# EAGLE design ownduino-metaboard2 (EAGLE 6.1)
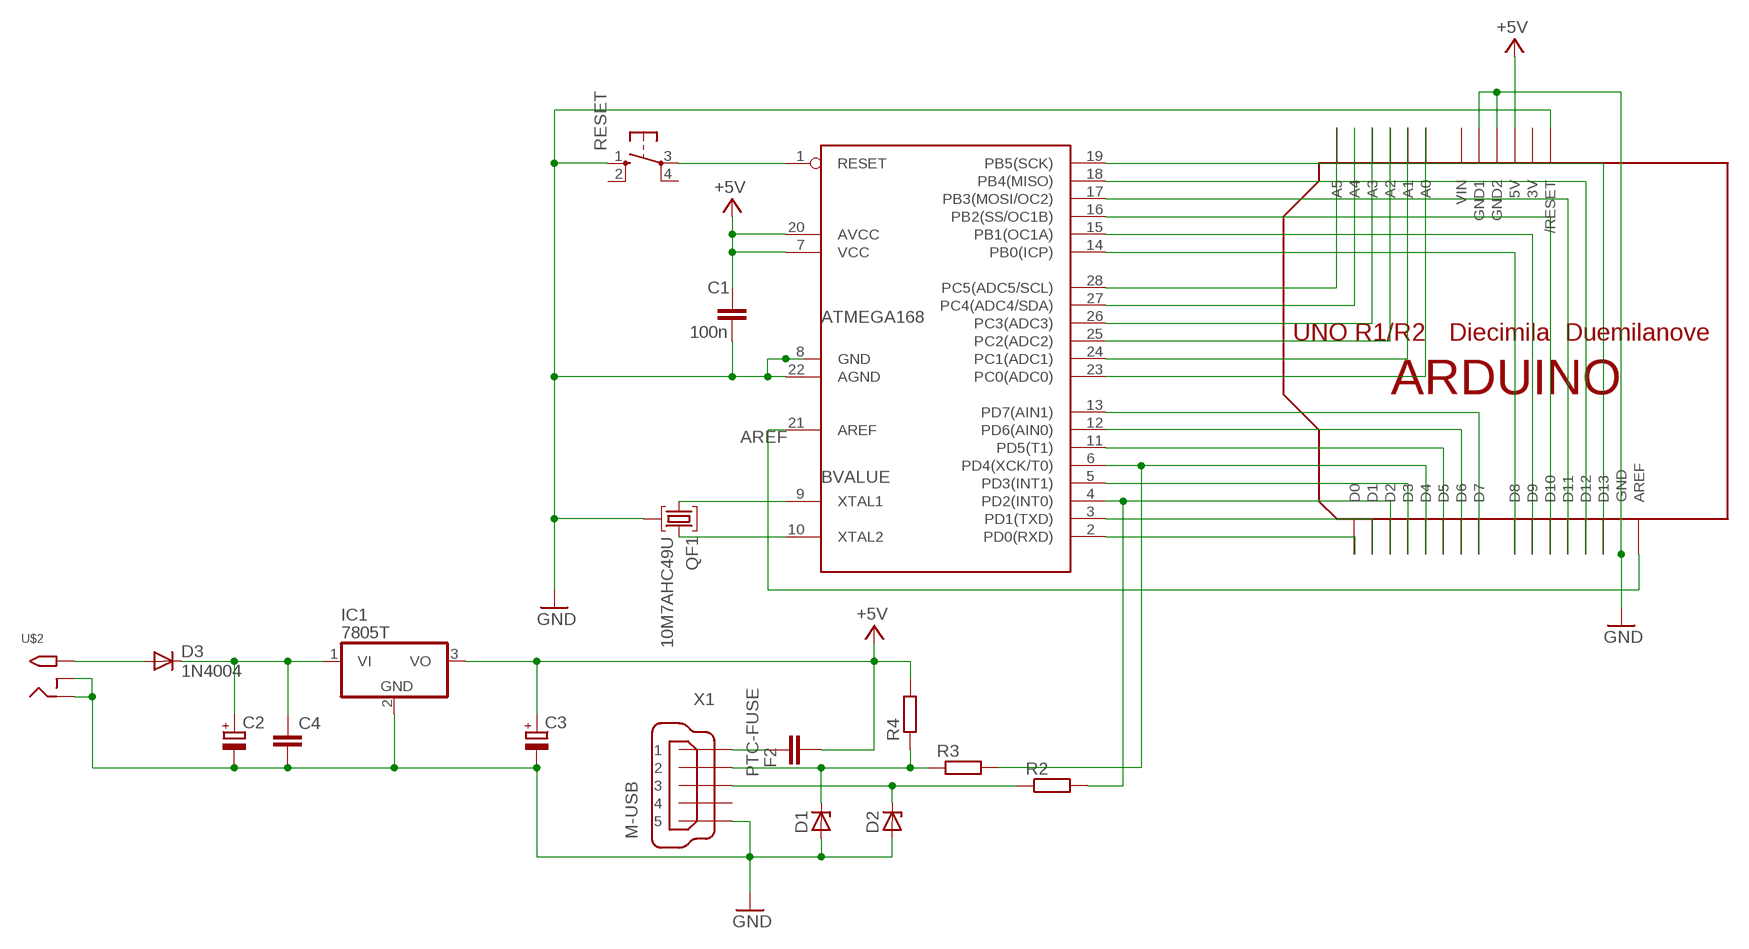
[diagram p0: schematic, sheet 1]

## Parts
BVALUE  ATMEGA168  MEGA8-P  [DIL28-3]
C1  100n  C-EU025-024X044  [C025-024X044]
C2  CPOL-EUE5-8.5  [E5-8,5]
C3  CPOL-EUE5-8.5  [E5-8,5]
C4  C-EU025-025X050  [C025-025X050]
D1  ZENER-DIODEZD-7.5  [ZDIO-7.5]
D2  ZENER-DIODEZD-5  [ZDIO-5]
D3  1N4004  [DO41-10]
F2  PTC-FUSE  C-EU025_050-025X075  [C025_050-025X075]
IC1  7805T  [TO220H]
QF1  10M7AHC49U  [HC49U]
R2  R-EU_0207/12  [0207/12]
R3  R-EU_0207/10  [0207/10]
R4  R-EU_0207/10  [0207/10]
RESET  10-XX  [B3F-10XX]
U$1  ARDUINOUNO  [ARDUINO]
U$2  2.1MMJACKTHM  [PJ-102A]
X1  M-USB  MINI-USB_SHIELD5P2-32005-601  [32005-601]

## Nets
+5V [power]: BVALUE.7(VCC) BVALUE.20(AVCC) C1.1 C3.+ F2.1 IC1.3(VO) R4.2 U$1.5V
A0: BVALUE.23(PC0(ADC0)) U$1.A0
A1: BVALUE.24(PC1(ADC1)) U$1.A1
A2: BVALUE.25(PC2(ADC2)) U$1.A2
A3: BVALUE.26(PC3(ADC3)) U$1.A3
A4: BVALUE.27(PC4(ADC4/SDA)) U$1.A4
A5: BVALUE.28(PC5(ADC5/SCL)) U$1.A5
AREF: BVALUE.21(AREF) U$1.AREF
D0: BVALUE.2(PD0(RXD)) U$1.D0
D1: BVALUE.3(PD1(TXD)) U$1.D1
D2: BVALUE.4(PD2(INT0)) R2.2 U$1.D2
D3: BVALUE.5(PD3(INT1)) U$1.D3
D4: BVALUE.6(PD4(XCK/T0)) R3.2 U$1.D4
D5: BVALUE.11(PD5(T1)) U$1.D5
D6: BVALUE.12(PD6(AIN0)) U$1.D6
D7: BVALUE.13(PD7(AIN1)) U$1.D7
D8: BVALUE.14(PB0(ICP)) U$1.D8
D9: BVALUE.15(PB1(OC1A)) U$1.D9
D10: BVALUE.16(PB2(SS/OC1B)) U$1.D10
D11-MOSI: BVALUE.17(PB3(MOSI/OC2)) U$1.D11
D12-MISO: BVALUE.18(PB4(MISO)) U$1.D12
D13-SCK: BVALUE.19(PB5(SCK)) U$1.D13
D+: D2.C R2.1 X1.3
D-: D1.C R3.1 R4.1 X1.2
GND [power]: BVALUE.8(GND) BVALUE.22(AGND) C1.2 C2.- C3.- C4.2 D1.A D2.A IC1.2(GND) QF1.2 RESET.1(S) U$1.GND U$1.GND1 U$1.GND2 U$1.RESET(/RESET) U$2.RING U$2.RING_SW X1.5
N$2: BVALUE.1(RESET) RESET.3(P)
N$3: C2.+ C4.1 D3.C IC1.1(VI)
N$4: D3.A U$2.TIP
N$5: BVALUE.9(XTAL1) QF1.1
N$6: BVALUE.10(XTAL2) QF1.3
N$38: F2.2 X1.1
Unconnected: RESET.2(S1) RESET.4(P1) X1.4 X1.M1(S1) X1.M2(S2)

## Power pins joined to a net without a drawn wire
3V: U$1.3V
VIN: U$1.VIN

## Library data of the parts
BVALUE = my-library:MEGA8-P: MICROCONTROLLER 8 Kbytes FLASH 1 kbytes SRAM 512 bytes EEPROM USART 4-channel 10 bit ADC 2-channel 8 bit ADC Source: avr.lbr
C1 C4 F2 = rcl:C-EU: CAPACITOR, European symbol
C2 C3 = rcl:CPOL-EU: POLARIZED CAPACITOR, European symbol
D1 D2 = diode:ZENER-DIODE: Z-Diode
D3 = diode:1N4004: DIODE general purpose rectifier, 1 A
IC1 = adafruit:78*: Positive VOLTAGE REGULATOR Added bigger pads to the TO-92 package
QF1 = crystal:10M*A: Monolithic Crystal Filters Source: www.vanlong.com; OC_FARNELL: unknown; OC_NEWARK: unknown
R2-R4 = rcl:R-EU_: RESISTOR, European symbol
RESET = switch-omron:10-XX: OMRON SWITCH
U$1 = adafruit:ARDUINO: Arduino Diecimila/Duemilanove Make a shield with ease, this package has all the named pins as well as the two mounting drill holes and an outline of the USB and DC power connector. The outline is on the DIMENSION layer, so if your board house uses it they will cut the outline to match. http://www.ladyada.net/library/pcb/eaglelibrary.html
U$2 = adafruit:2.1MMJACK: 2.1mm x 5.5mm THM DC jack with internal switch. Digikey part #PJ-102A, 4UCON part #05537 2.1mm x 5.5mm SMT DC jack with internal switch. Digikey part #PJ-002A-SMT, 4UCON part #03267 By microbuilder.eu & adafruit.com
X1 = con-cypressindustries:MINI-USB_SHIELD5P2-: MINI USB-B R/A DIP 5pol. Source: www.cypressindustries.com; OC_FARNELL: unknown; OC_NEWARK: unknown

## Net classes
0 default: width 0.203 mm, clearance 0.203 mm
1 power: width 0.6 mm, clearance 0.305 mm
2 finepitch: width 0.203 mm, clearance 0.203 mm

## Board
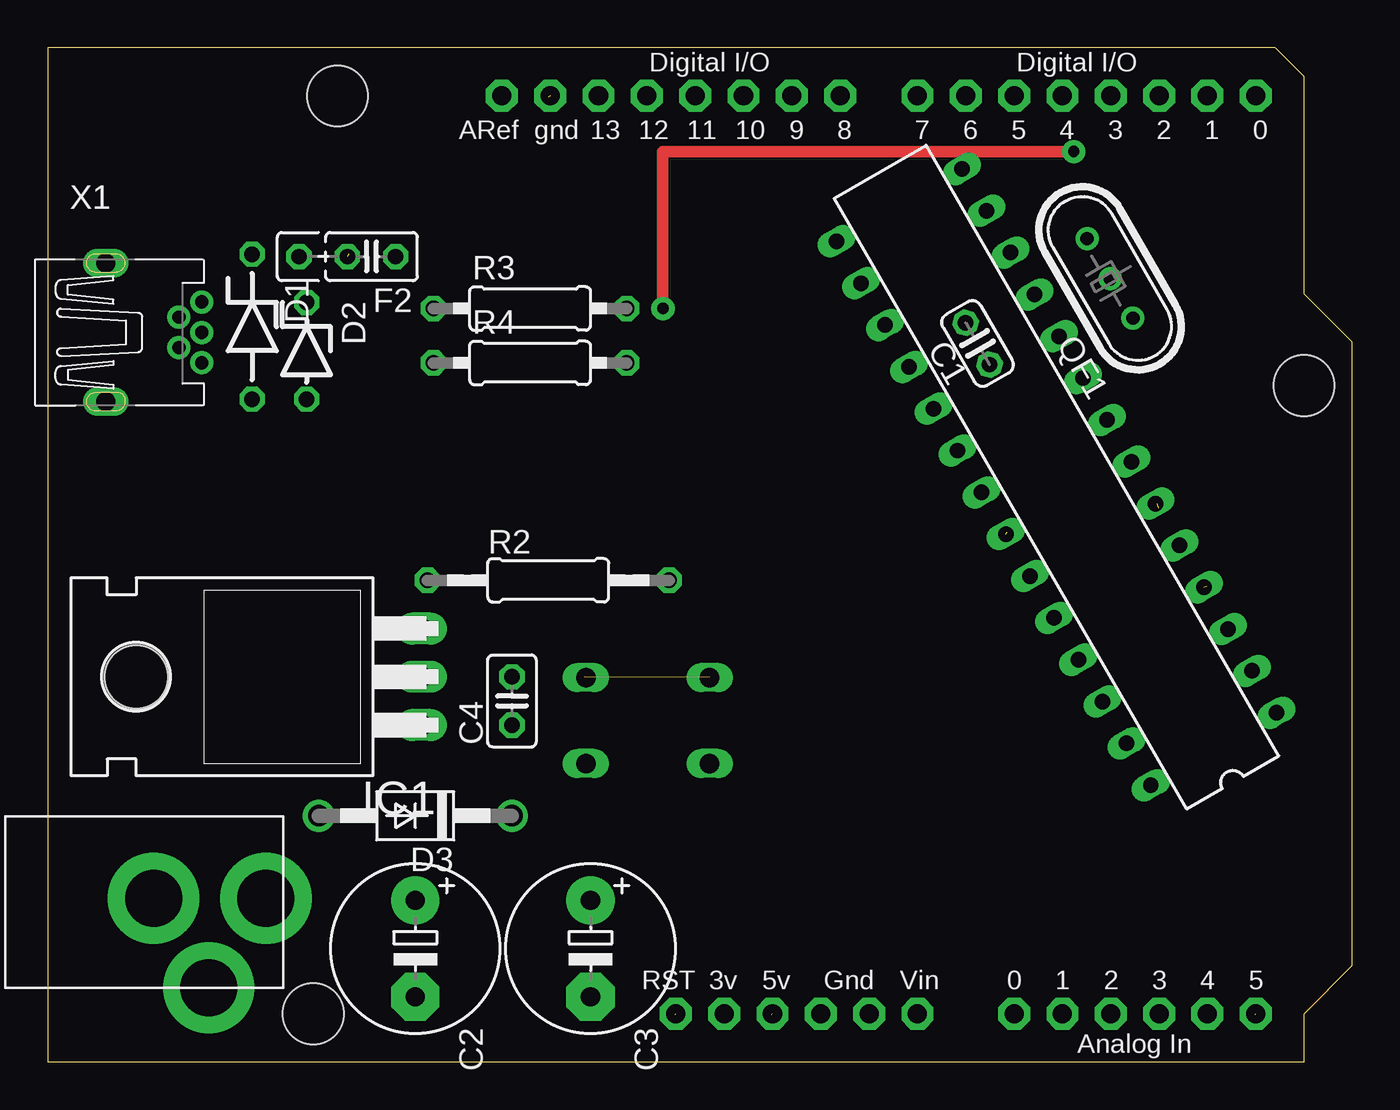
[diagram p1: board, top side]
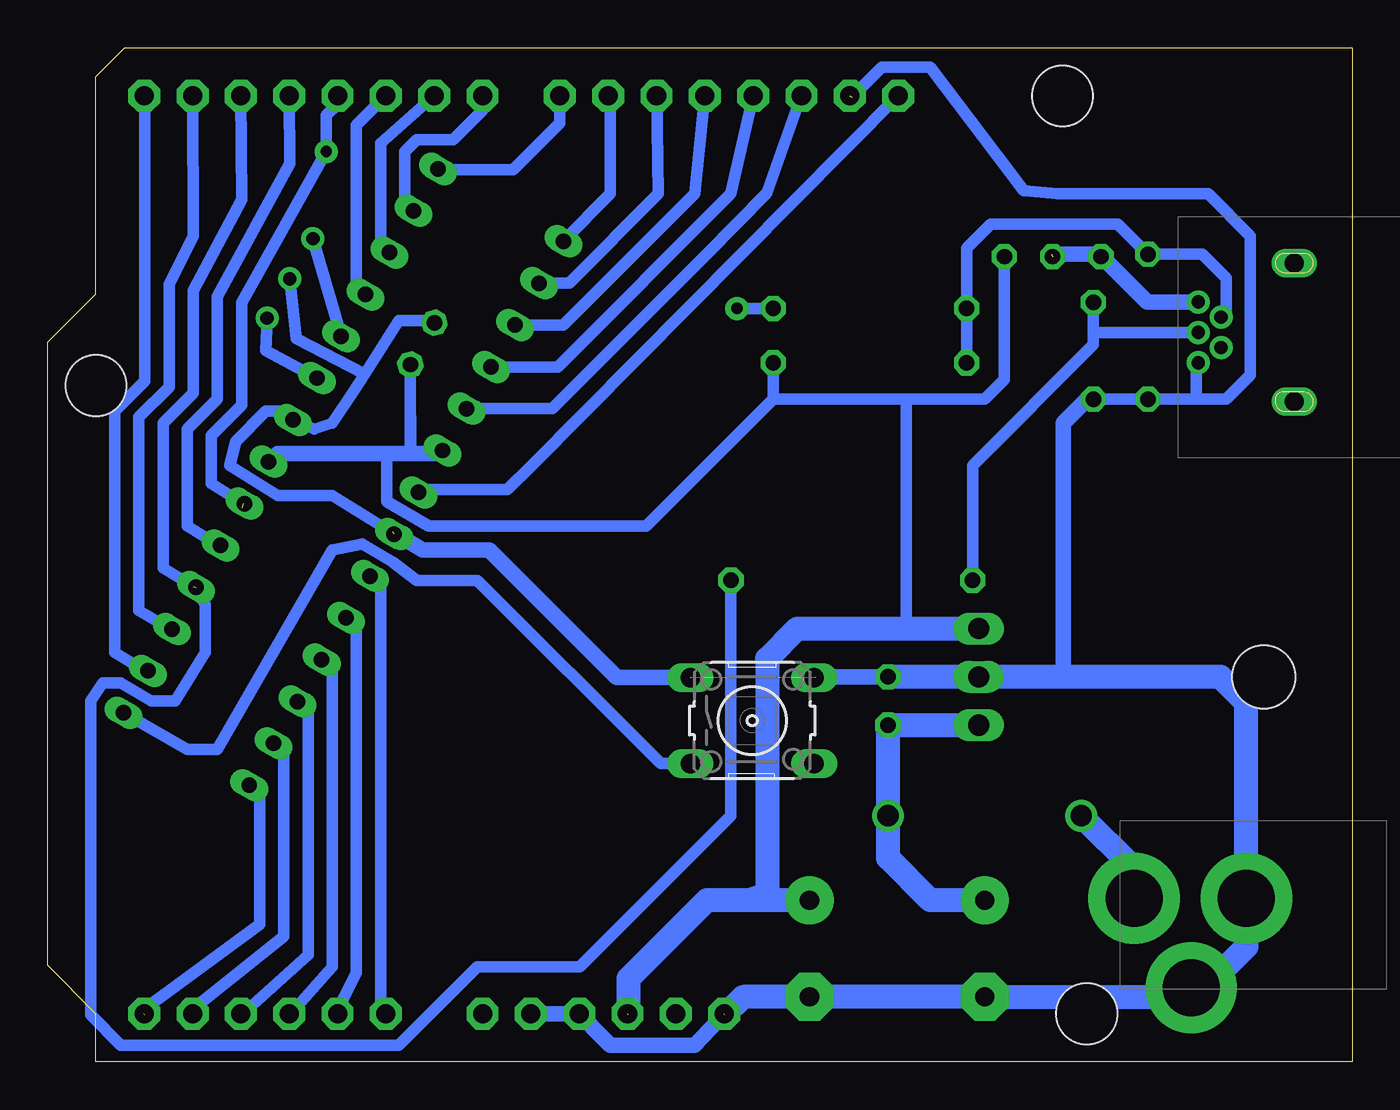
[diagram p2: board, bottom side, seen from below]

Size 68.58 x 53.34 mm. Coordinates in mm from the lower left corner, seen from the top.
Copper layers (1*16): Top 0.035mm / dielectric 1.5mm / Bottom 0.035mm
Design rules: minimum track width 10mil, minimum drill 0.6mm, track to track 8mil, track to pad 8mil, pad to pad 8mil, via to via 12mil, smd to smd 8mil, copper to edge 10mil, drill to drill 15mil, minimum pad ring 10mil, minimum via ring 12mil, stop-mask expansion 4mil, vias tented up to drill 0mil, thermal gap 10mil
Holes 3.2 mm at 67.03,138.64 67.03,110.7 16.23,153.88
tRestrict: area 14.3,152 to 18.1,155.8; area 65.1,136.7 to 68.9,140.5; area 65.1,108.8 to 68.9,112.6; 10 lines
bRestrict: area 14.3,152 to 18.1,155.8; area 65.1,136.7 to 68.9,140.5; area 65.1,108.8 to 68.9,112.6; 8 lines

### Footprints (pad centres in the part's own frame; a part is rotated, then mirrored left to right if it is on the bottom)
DIL28-3 = drill 0.813 long: 1 -16.51,-3.81; 2 -13.97,-3.81; 3 -11.43,-3.81; 4 -8.89,-3.81; 5 -6.35,-3.81; 6 -3.81,-3.81; 7 -1.27,-3.81; 8 1.27,-3.81; 9 3.81,-3.81; 10 6.35,-3.81; 11 8.89,-3.81; 12 11.43,-3.81; 13 13.97,-3.81; 14 16.51,-3.81; 15 16.51,3.81; 16 13.97,3.81; 17 11.43,3.81; 18 8.89,3.81; 19 6.35,3.81; 20 3.81,3.81; 21 1.27,3.81; 22 -1.27,3.81; 23 -3.81,3.81; 24 -6.35,3.81; 25 -8.89,3.81; 26 -11.43,3.81; 27 -13.97,3.81; 28 -16.51,3.81
C025-024X044 = drill 0.813 octagon: 1 -1.27,0; 2 1.27,0
E5-8,5 = drill 1.016 pad 2.54: + -2.54,0 | drill 1.016 pad 2.54 octagon: - 2.54,0
C025-025X050 = drill 0.813 octagon: 1 -1.27,0; 2 1.27,0
ZDIO-7.5 = drill 0.813 octagon: A 3.81,0; C -3.81,0
ZDIO-5 = drill 0.813 octagon: A 2.54,0; C -2.54,0
DO41-10 = drill 1.118: A 5.08,0; C -5.08,0
C025_050-025X075 = drill 0.813 octagon: 1 -1.27,0; 2 1.27,0; 3 3.81,0
TO220H = drill 1.118 long: 1 -2.54,-10.16; 2 0,-10.16; 3 2.54,-10.16 | hole 3.302: 0,4.826
HC49U = drill 0.7 pad 1.2: 1 -2.413,0; 2 -0.027,0; 3 2.413,0
0207/12 = drill 0.813 octagon: 1 -6.35,0; 2 6.35,0
0207/10 = drill 0.813 octagon: 1 -5.08,0; 2 5.08,0
B3F-10XX = drill 1.016 long: 1 -3.251,2.261; 2 3.251,2.261; 3 -3.251,-2.261; 4 3.251,-2.261
ARDUINO = drill 1 pad 1.676 octagon: 3V 35.56,2.54; 5V 38.1,2.54; A0 50.8,2.54; A1 53.34,2.54; A2 55.88,2.54; A3 58.42,2.54; A4 60.96,2.54; A5 63.5,2.54; AREF 23.876,50.8; D0 63.5,50.8; D1 60.96,50.8; D2 58.42,50.8; D3 55.88,50.8; D4 53.34,50.8; D5 50.8,50.8; D6 48.26,50.8; D7 45.72,50.8; D8 41.656,50.8; D9 39.116,50.8; D10 36.576,50.8; D11 34.036,50.8; D12 31.496,50.8; D13 28.956,50.8; GND 26.416,50.8; GND1 43.18,2.54; GND2 40.64,2.54; RESET 33.02,2.54; VIN 45.72,2.54 | hole 3.2: 15.24,50.8; 66.04,35.56; 13.97,2.54
PJ-102A = drill 3 pad 4.8: RING 0.1,-3.39; RING_SW -4.6,-6.29; TIP 0.1,-9.29
32005-601 = drill 0.7 pad 1.016: 1 2.825,1.6; 2 1.625,0.8; 3 2.825,0; 4 1.625,-0.8; 5 2.825,-1.6 | drill 1 pad 1.422 long: M1 -2.225,3.65; M2 -2.225,-3.65

### Placement (x,y rotation side)
BVALUE  53.03,30.76 120 top
C1  48.88,37.77 120 top
C2  19.33,5.96 270 top
C3  28.54,5.96 270 top
C4  24.41,18.98 90 top
D1  10.76,38.67 270 top
D2  13.61,37.4 270 top
D3  19.33,12.95 180 top
F2  17.03,42.35 180 top
IC1  9.49,20.25 90 top
QF1  55.84,41.21 120 top
R2  26.31,25.33 0 top
R3  25.36,39.62 0 top
R4  25.36,36.76 0 top
RESET  31.54,17.95 0 bottom
U$1  0,0 0 top
U$2  2.18,8.5 90 top
X1  5.28,38.36 0 top

### Tracks (layer width: path | path; a pad name or v marks a point on that pad's centre or on a via)
+5V  (1 unrouted)
  Bottom 0.61: 48.22,32 BVALUE.20 50.76,32 50.76,29.46 48.54,28.19 37.11,28.19 30.44,34.85 | F2.1 18.3,35.88 19.33,34.85 23.46,34.85 | 30.12,36.76 30.44,36.44 R4.2 30.44,34.85 | 23.46,22.79 23.46,34.85 | 23.46,34.85 30.44,34.85 | C1.1 49.52,32.02 49.49,32 49.49,33.9
  Bottom 0.813: 48.22,32 49.49,32 50.76,32 56.47,32 BVALUE.7
  Bottom 1.27: 38.06,2.47 38.06,4.37 33.93,8.5 31.71,8.5 | IC1.3 23.46,22.79 29.17,22.79 30.76,21.2 30.76,8.82 31.71,8.5 | C3.+ 31.71,8.5
A0
  Bottom 0.61: BVALUE.23 51.3,25.55 51.08,25.33 51.08,2.82 U$1.A0
A1
  Bottom 0.61: BVALUE.24 52.59,23.35 52.35,23.11 52.35,4.69 53.3,2.79 53.3,2.58 U$1.A1
A2
  Bottom 0.61: BVALUE.25 53.88,21.15 53.62,20.88 53.62,5.01 55.84,2.47 55.84,2.58 U$1.A2
A3
  Bottom 0.61: BVALUE.26 55.44,18.9 54.89,18.35 54.89,5.65 58.38,2.47 U$1.A3
A4
  Bottom 0.61: BVALUE.27 56.47,16.75 56.16,16.44 56.16,6.6 60.92,2.79 U$1.A4
A5  (1 unrouted)
  Bottom 0.61: BVALUE.28 57.76,14.55 57.43,14.22 57.43,7.23 63.46,2.79 63.46,2.47 63.46,2.15
AREF
  Bottom 0.61: U$1.AREF 43.14,31.36 44.41,30.09 49.17,30.09 48.86,29.77 BVALUE.21
D0
  Bottom 0.61: BVALUE.2 63.46,20.57 65.05,21.52 65.05,34.22 63.46,35.81 63.46,50.73 U$1.D0
D1
  Bottom 0.61: U$1.D1 60.92,43.43 62.19,40.89 62.19,35.49 63.78,33.9 63.78,23.74 62.19,22.79 BVALUE.3
D2  (1 unrouted)
  Bottom 0.61: U$1.D2 58.38,45.33 60.92,40.57 60.92,35.17 62.51,33.59 62.51,25.96 60.92,25.01 | BVALUE.4 60.29,24.06 60.29,21.52 61.87,18.98 63.14,18.98 64.73,19.93 65.68,19.93 66.32,18.98 66.32,2.47 64.73,0.88 50.12,0.88 46,5.01 40.6,5.01 32.66,12.95 R2.2
D3
  Bottom 0.61: BVALUE.5 59.58,27.16 61.24,28.19 61.24,33.27 59.65,34.85 59.65,40.25 55.84,47.24 U$1.D3
D4  (via drill 0.6)  (1 unrouted)
  Top 0.61: v53.94,47.87 32.35,47.87 v32.35,39.62
  Bottom 0.61: U$1.D4 53.34,50.37 53.94,49.78 v53.94,47.87 58.38,39.94 58.38,34.54 59.97,32.95 59.97,30.41 58.28,29.36 BVALUE.6 | 58.7,29.83 58.38,29.14 | v32.35,39.62 R3.2
D5
  Bottom 0.61: U$1.D5 52.35,49.25 52.35,40.89 51.88,40.42 BVALUE.11
D6
  Bottom 0.61: U$1.D6 51.08,48.3 51.08,43.11 50.61,42.64 BVALUE.12
D7
  Bottom 0.61: BVALUE.13 49.81,45.23 49.81,47.87 49.17,48.51 47.27,48.51 45.72,50.06 U$1.D7
D8
  Bottom 0.61: U$1.D8 41.66,49.36 44.09,46.92 48.03,46.92 BVALUE.14
D9
  Bottom 0.61: U$1.D9 39.01,50.73 39.01,45.65 BVALUE.15
D10
  Bottom 0.61: BVALUE.16 41.17,40.95 36.47,45.65 U$1.D10
D11-MOSI
  Bottom 0.61: BVALUE.17 41.47,38.75 34.57,45.65 U$1.D11
D12-MISO
  Bottom 0.61: BVALUE.18 41.76,36.55 32.66,45.65 U$1.D12
D13-SCK
  Bottom 0.61: BVALUE.19 42.06,34.35 33.93,42.48 30.79,45.67 U$1.D13
D+
  Bottom 0.61: X1.3 13.6,38.36 13.61,38.35 D2.C 13.61,37.71 19.96,31.36 R2.1
D-
  Bottom 0.61: X1.2 6.63,39.44 6.63,41.2 7.9,42.48 D1.C 12.34,44.06 19.01,44.06 20.28,42.79 R3.1 R4.1
GND  (4 unrouted)
  Bottom 0.61: QF1.2 55.52,38.03 51.92,36.17 | 13.3,34.85 D1.A 8.22,34.85 | 8.22,34.85 6.63,34.85 5.36,36.12 5.36,43.43 7.58,45.65 15.52,45.65 17.26,45.81 22.19,52.32 24.72,52.32 26.31,50.73 | X1.5 8.22,36.65 8.22,34.85 | BVALUE.22 53.62,29.77 56.47,29.77 59.01,31.36 58.7,32.63 57.11,34.22 56.47,34.22 BVALUE.8 54.57,33.27 53.62,33.59 52.49,35.27 | 52.35,35.49 52.49,35.27 | C1.2 48.25,38.96 48.22,38.98 50.12,38.98 51.92,36.17 | 51.92,36.17 52.49,35.27
  Bottom 0.813: U$1.GND1 U$1.GND2 39.33,1.2 39.01,0.88 34.57,0.88 U$1.RESET | 15.2,20.25 15.2,33.59 13.93,34.85 D2.A 13.3,34.85 | 50.44,27.87 48.86,26.92 45.36,26.92 38.66,20.21 RESET.1 | C4.2 28.22,20.25
  Bottom 1.27: 32.98,2.47 32.03,3.42 C3.- C2.- 8.22,3.42 | C4.2 IC1.2 15.2,20.25 6.94,20.25 5.57,18.88 U$2.RING 5.57,6.07 8.22,3.42 | 8.22,3.42 8.22,3.65 U$2.RING_SW
N$2
  Bottom 0.61: BVALUE.1 61.24,16.44 59.65,16.44 53.62,26.92 52.03,27.24 50.44,26.28 49.17,25.33 46,25.33 36.36,15.69 RESET.3
N$3
  Bottom 1.27: C2.+ 22.19,8.5 24.41,10.73 D3.C C4.1 IC1.1
N$4
  Bottom 1.27: U$2.TIP 11.47,10.17 D3.A
N$5
  Bottom 0.61: QF1.1 57.11,37.4 BVALUE.9
N$6
  Bottom 0.61: QF1.3 BVALUE.10
N$38  (1 unrouted)
  Bottom 0.813: X1.1 10.78,39.96 13.3,42.48 15.83,42.48

### Text on the board
tNames: F1
Edit History: 20070917 WestfW: Move (CC) symbol, use silk_gen to get 5mil widths | 20070917 WestfW: Manual route some, autoroute rest. Fiddle. | 20070917 WestfW: Now V1.16. Change components to TH. | 20070911 WestfW: Now V1.15. Move tracks slightly for shielding | 20070900 Daniel: Schematic and initial placement
_tsilk: C12 | C8 | 3 2 1 0 9 8 | 7 6 5 4 3 2 1 0 | RX | TX | 1 1 1 1 | Digital | X2 | AREF | GND | R7 | PWM | PWM | PWM | PWM | PWM | PWM | PWR | IC1 | 13 | Freeduino | FT232RL | c | c | R10 | V1.16 | TX | R8 | RX | 16Mhz | 1 | R1 | R9 | C3 | C10 | R12 | ]USB | R11 | ]EXT | F1 | Q1 | C2 | ICSP | RESET | 1 | CRS | M. Banzi | D. Cuartielles | D. Mellis | N. Zambetti | C5 | C4 | ATMEGA168 | IC2 | D1 | C1 | 47u | C7 | 47u | C6 | C9 | Analog in | 5V Gnd 9V | RESET | 3.3V | 0 1 2 3 4 5 | 9V in